# EAGLE schematic PAB_cricuit_layout (EAGLE 9.2.2)
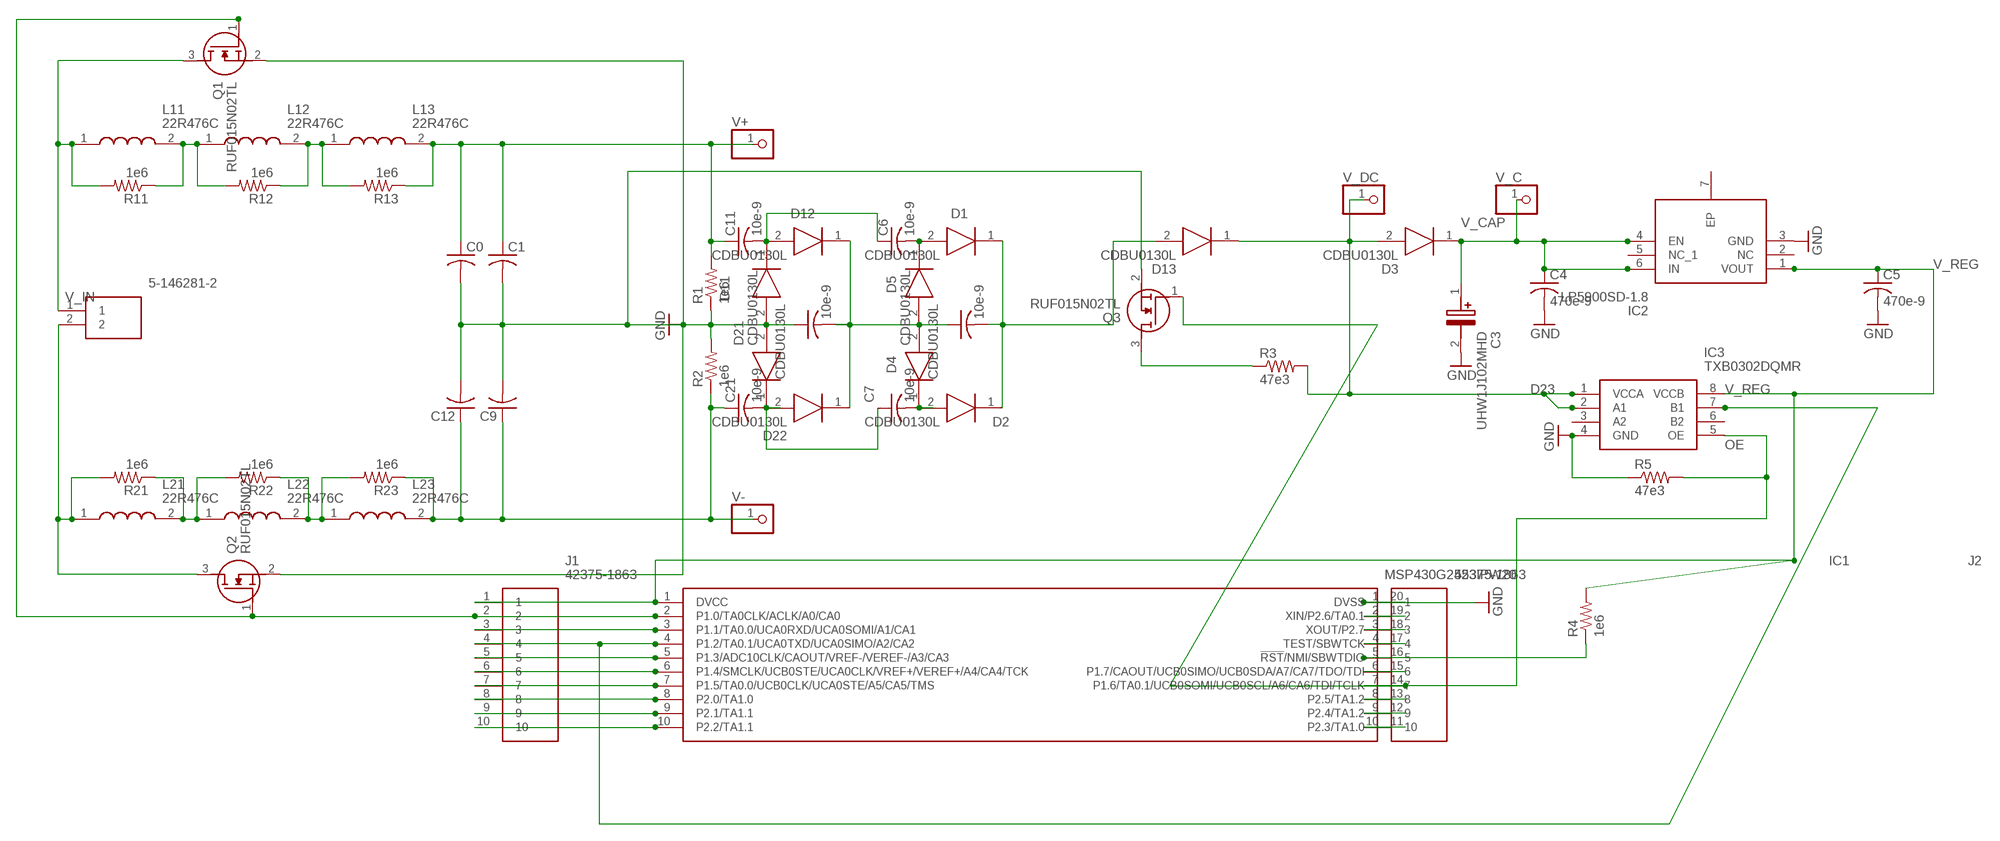
[diagram p0: schematic, sheet 1]

## Parts
C0  C-USC0603  [C0603]
C1  C-USC0603  [C0603]
C3  UHW1J102MHD  [CAPPRD500W80D1250H4200]
C4  470e-9  C-USC0603  [C0603]
C5  470e-9  C-USC0603  [C0603]
C6  10e-9  C-USC0603  [C0603]
C7  10e-9  C-USC0603  [C0603]
C8  10e-9  C-USC0603  [C0603]
C9  C-USC0603  [C0603]
C11  10e-9  C-USC0603  [C0603]
C12  C-USC0603  [C0603]
C21  10e-9  C-USC0603  [C0603]
C22  10e-9  C-USC0603  [C0603]
D1  CDBU0130L  [DIOM179X85N]
D2  CDBU0130L  [DIOM179X85N]
D3  CDBU0130L  [DIOM179X85N]
D4  CDBU0130L  [DIOM179X85N]
D5  CDBU0130L  [DIOM179X85N]
D11  CDBU0130L  [DIOM179X85N]
D12  CDBU0130L  [DIOM179X85N]
D13  CDBU0130L  [DIOM179X85N]
D21  CDBU0130L  [DIOM179X85N]
D22  CDBU0130L  [DIOM179X85N]
IC1  MSP430G2553IPW20  [SOP65P640X120-20N]
IC2  LP5900SD-1.8  [SON65P250X220X80-7N]
IC3  TXB0302DQMR  [SON40P120X180X40-8N]
J1  42375-1863  [HDRV10W87P0X254_1X10_2540X249X]
J2  42375-1863  [HDRV10W87P0X254_1X10_2540X249X]
L11  22R476C  [22R335C]
L12  22R476C  [22R335C]
L13  22R476C  [22R335C]
L21  22R476C  [22R335C]
L22  22R476C  [22R335C]
L23  22R476C  [22R335C]
Q1  RUF015N02TL  [SOT65P210X85-3N]
Q2  RUF015N02TL  [SOT65P210X85-3N]
Q3  RUF015N02TL  [SOT65P210X85-3N]
R1  1e6  R-US_R0603  [R0603]
R2  1e6  R-US_R0603  [R0603]
R3  47e3  R-US_R0603  [R0603]
R4  1e6  R-US_R0603  [R0603]
R5  47e3  R-US_R0603  [R0603]
R11  1e6  R-US_R0603  [R0603]
R12  1e6  R-US_R0603  [R0603]
R13  1e6  R-US_R0603  [R0603]
R21  1e6  R-US_R0603  [R0603]
R22  1e6  R-US_R0603  [R0603]
R23  1e6  R-US_R0603  [R0603]
V+  PINHD-1X1  [1X01]
V-  PINHD-1X1  [1X01]
V_C  PINHD-1X1  [1X01]
V_DC  PINHD-1X1  [1X01]
V_IN  5-146281-2  [HDRV2W67P0X254_1X2_721X234X821]

## Nets
D23: D3.2(K) D13.1(A) IC3.1(VCCA) IC3.2(A1) R3.2 V_DC.1
GND: C0.2 C1.2 C3.2(-) C4.2 C5.2 C9.2 C12.2 C22.1 D11.2(K) D21.2(K) IC1.20(DVSS) IC2.3(GND) IC3.4(GND) J2.1 Q1.2(S) Q2.2(S) Q3.2(S) R1.1 R2.2 R5.1
J3: C8.1 D4.2(K) D5.2(K)
N$1: C6.1 C11.2 D11.1(A) D12.2(K)
N$2: C22.2 D12.1(A) D22.1(A)
N$3: L11.2 L12.1 R11.1 R12.2
N$4: L21.2 L22.1 R21.1 R22.2
N$5: L21.1 Q2.3(D) R21.2 V_IN.2
N$6: C7.1 C21.2 D21.1(A) D22.2(K)
N$7: C7.2 D2.2(K) D4.1(A)
N$8: L12.2 L13.1 R12.1 R13.2
N$9: IC1.4(P1.2/TA0.1/UCA0TXD/UCA0SIMO/A2/CA2) IC3.7(B1) J1.4
N$10: IC1.3(P1.1/TA0.0/UCA0RXD/UCA0SOMI/A1/CA1) J1.3
N$11: IC1.5(P1.3/ADC10CLK/CAOUT/VREF-/VEREF-/A3/CA3) J1.5
N$13: IC1.6(P1.4/SMCLK/UCB0STE/UCA0CLK/VREF+/VEREF+/A4/CA4/TCK) J1.6
N$14: L22.2 L23.1 R22.1 R23.2
N$15: IC1.7(P1.5/TA0.0/UCB0CLK/UCA0STE/A5/CA5/TMS) J1.7
N$16: IC1.8(P2.0/TA1.0) J1.8
N$17: IC1.9(P2.1/TA1.1) J1.9
N$18: IC1.10(P2.2/TA1.1) J1.10
N$19: IC1.2(P1.0/TA0CLK/ACLK/A0/CA0) J1.2 Q1.1(G) Q2.1(G)
N$20: Q3.3(D) R3.1
N$21: IC1.19(XIN/P2.6/TA0.1) J2.2
N$22: IC1.18(XOUT/P2.7) J2.3
N$23: IC1.17(TEST/SBWTCK) J2.4
N$24: IC1.16(!RST!/NMI/SBWTDIO) J2.5 R4.1
N$25: IC1.15(P1.7/CAOUT/UCB0SIMO/UCB0SDA/A7/CA7/TDO/TDI) J2.6
N$26: C9.1 C12.1 C21.1 L23.2 R2.1 R23.1 V-.1
N$27: IC1.13(P2.5/TA1.2) J2.8
N$28: IC1.12(P2.4/TA1.2) J2.9
N$29: IC1.11(P2.3/TA1.0) J2.10
N$30: C6.2 D1.2(K) D5.1(A)
N$32: C8.2 D1.1(A) D2.1(A) D13.2(K)
OE: IC1.14(P1.6/TA0.1/UCB0SOMI/UCB0SCL/A6/CA6/TDI/TCLK) IC3.5(OE) J2.7 Q3.1(G) R5.2
V+: C0.1 C1.1 C11.1 L13.2 R1.2 R13.1 V+.1
V_CAP: C3.1(+) C4.1 D3.1(A) IC2.4(EN) IC2.6(IN) V_C.1
V_IN+: L11.1 Q1.3(D) R11.2 V_IN.1
V_REG: C5.1 IC1.1(DVCC) IC2.1(VOUT) IC3.8(VCCB) J1.1 R4.2
Unconnected: IC2.2(NC) IC2.5(NC_1) IC3.3(A2) IC3.6(B2)

## Power pins joined to a net without a drawn wire
EP: IC2.7(EP)

## Library data of the parts
C0 C1 C4-C9 C11 C12 C21 C22 = rcl:C-US: CAPACITOR, American symbol; SPICEPREFIX: C
C3 = SamacSys_Parts:UHW1J102MHD: Aluminum Electrolytic Capacitors - Radial Leaded 63V 1000uF 20% Source: Datasheet <https://componentsearchengine.com/Datasheets/1/UHW1J102MHD.pdf>; DESCRIPTION: Aluminum Electrolytic Capacitors - Radial Leaded 63V 1000uF 20%; HEIGHT: 42mm; MANUFACTURER_NAME: Nichicon; MANUFACTURER_PART_NUMBER: UHW1J102MHD; MOUSER_PART_NUMBER: 647-UHW1J102MHD
D1-D5 D11-D13 D21 D22 = SamacSys_Parts:CDBU0130L: NewCOMCHIP TECHNOLOGY CDBU0130L, SMT Schottky Diode, 35V 100mA, 2-Pin SOD-523F (0603) Source: Datasheet <https://componentsearchengine.com/Datasheets/1/CDBU0130L.pdf>; DESCRIPTION: NewCOMCHIP TECHNOLOGY CDBU0130L, SMT Schottky Diode, 35V 100mA, 2-Pin SOD-523F (0603); HEIGHT: 0.85mm; MANUFACTURER_NAME: Comchip Technology; MANUFACTURER_PART_NUMBER: CDBU0130L; MOUSER_PART_NUMBER: 750-CDBU0130L
IC1 = SamacSys_Parts:MSP430G2553IPW20: Mixed Signal MCU MSP430 16K Flash TSSOP Mixed Signal MCU MSP430 16K Flash TSSOP Source: Datasheet <http://www.ti.com/lit/ds/symlink/msp430g2553.pdf>; DESCRIPTION: Mixed Signal MCU MSP430 16K Flash TSSOP Mixed Signal MCU MSP430 16K Flash TSSOP; HEIGHT: 1.2mm; MANUFACTURER_NAME: Texas Instruments; MANUFACTURER_PART_NUMBER: MSP430G2553IPW20; MOUSER_PART_NUMBER: 595-MSP430G2553IPW20
IC2 = SamacSys_Parts:LP5900SD-1.8: .Low-Noise 100mA LDO,LP5900SD-1.8 Source: Datasheet <http://www.ti.com/general/docs/suppproductinfo.tsp?distId=26&gotoUrl=http://www.ti.com/lit/gpn/lp5900>; DESCRIPTION: .Low-Noise 100mA LDO,LP5900SD-1.8; HEIGHT: 0.8mm; MANUFACTURER_NAME: Texas Instruments; MANUFACTURER_PART_NUMBER: LP5900SD-1.8; MOUSER_PART_NUMBER: 926-LP5900SD-18
IC3 = SamacSys_Parts:TXB0302DQMR: 2-BIT BIDIRECTIONAL VOLTAGE-LEVEL TRANSLATOR Source: Datasheet <http://www.ti.com/lit/gpn/txb0302>; DESCRIPTION: 2-BIT BIDIRECTIONAL VOLTAGE-LEVEL TRANSLATOR; HEIGHT: 0.4mm; MANUFACTURER_NAME: Texas Instruments; MANUFACTURER_PART_NUMBER: TXB0302DQMR; MOUSER_PART_NUMBER: 595-TXB0302DQMR
J1 J2 = SamacSys_Parts:42375-1863: Headers & Wire Housings 10CKT BKWY HDR Source: Datasheet <https://componentsearchengine.com/Datasheets/1/42375-1863.pdf>; DESCRIPTION: Headers & Wire Housings 10CKT BKWY HDR; HEIGHT: 8.38mm; MANUFACTURER_NAME: Molex; MANUFACTURER_PART_NUMBER: 42375-1863; MOUSER_PART_NUMBER: 538-42375-1863
L11-L13 L21-L23 = SamacSys_Parts:22R476C: Murata 47000 H 10% Power Inductor, Max SRF:0.25MHz, Q:90, 27mA Idc, 169.4 Rdc 2200R Source: Datasheet <https://componentsearchengine.com/Datasheets/1/22R476C.pdf>; DESCRIPTION: Murata 47000 H 10% Power Inductor, Max SRF:0.25MHz, Q:90, 27mA Idc, 169.4 Rdc 2200R; HEIGHT: mm; MANUFACTURER_NAME: Murata Electronics; MANUFACTURER_PART_NUMBER: 22R476C; MOUSER_PART_NUMBER: 580-22R476C
Q1-Q3 = SamacSys_Parts:RUF015N02TL: Rohm, MOSFET, RUF015N02TL ROHM RUF015N02TL N-channel MOSFET Transistor, 1.5 A, 20 V, 3-Pin TUMT Source: Datasheet <https://componentsearchengine.com/Datasheets/1/RUF015N02TL.pdf>; DESCRIPTION: Rohm, MOSFET, RUF015N02TL ROHM RUF015N02TL N-channel MOSFET Transistor, 1.5 A, 20 V, 3-Pin TUMT; HEIGHT: 0.85mm; MANUFACTURER_NAME: ROHM Semiconductor; MANUFACTURER_PART_NUMBER: RUF015N02TL; MOUSER_PART_NUMBER: 755-RUF015N02TL
R1-R5 R11-R13 R21-R23 = rcl:R-US_: RESISTOR, American symbol; SPICEPREFIX: R
V+ V- V_C V_DC = pinhead:PINHD-1X1: PIN HEADER
V_IN = SamacSys_Parts:5-146281-2: AMP Modu II Breakaway Header,vertical,2w TE Connectivity Mod II Series, 2.54mm Pitch 2 Way 1 Row Straight PCB Header, Solder Termination, 3A Source: Datasheet <https://componentsearchengine.com/Datasheets/1/5-146281-2.pdf>; DESCRIPTION: AMP Modu II Breakaway Header,vertical,2w TE Connectivity Mod II Series, 2.54mm Pitch 2 Way 1 Row Straight PCB Header, Solder Termination, 3A; HEIGHT: 8.21mm; MANUFACTURER_NAME: TE Connectivity; MANUFACTURER_PART_NUMBER: 5-146281-2; MOUSER_PART_NUMBER: 571-5-146281-2

## Net classes
0 default: clearance 0.205 mm